# Altium schematic sheet 10-M2_GPS.SchDoc
size B
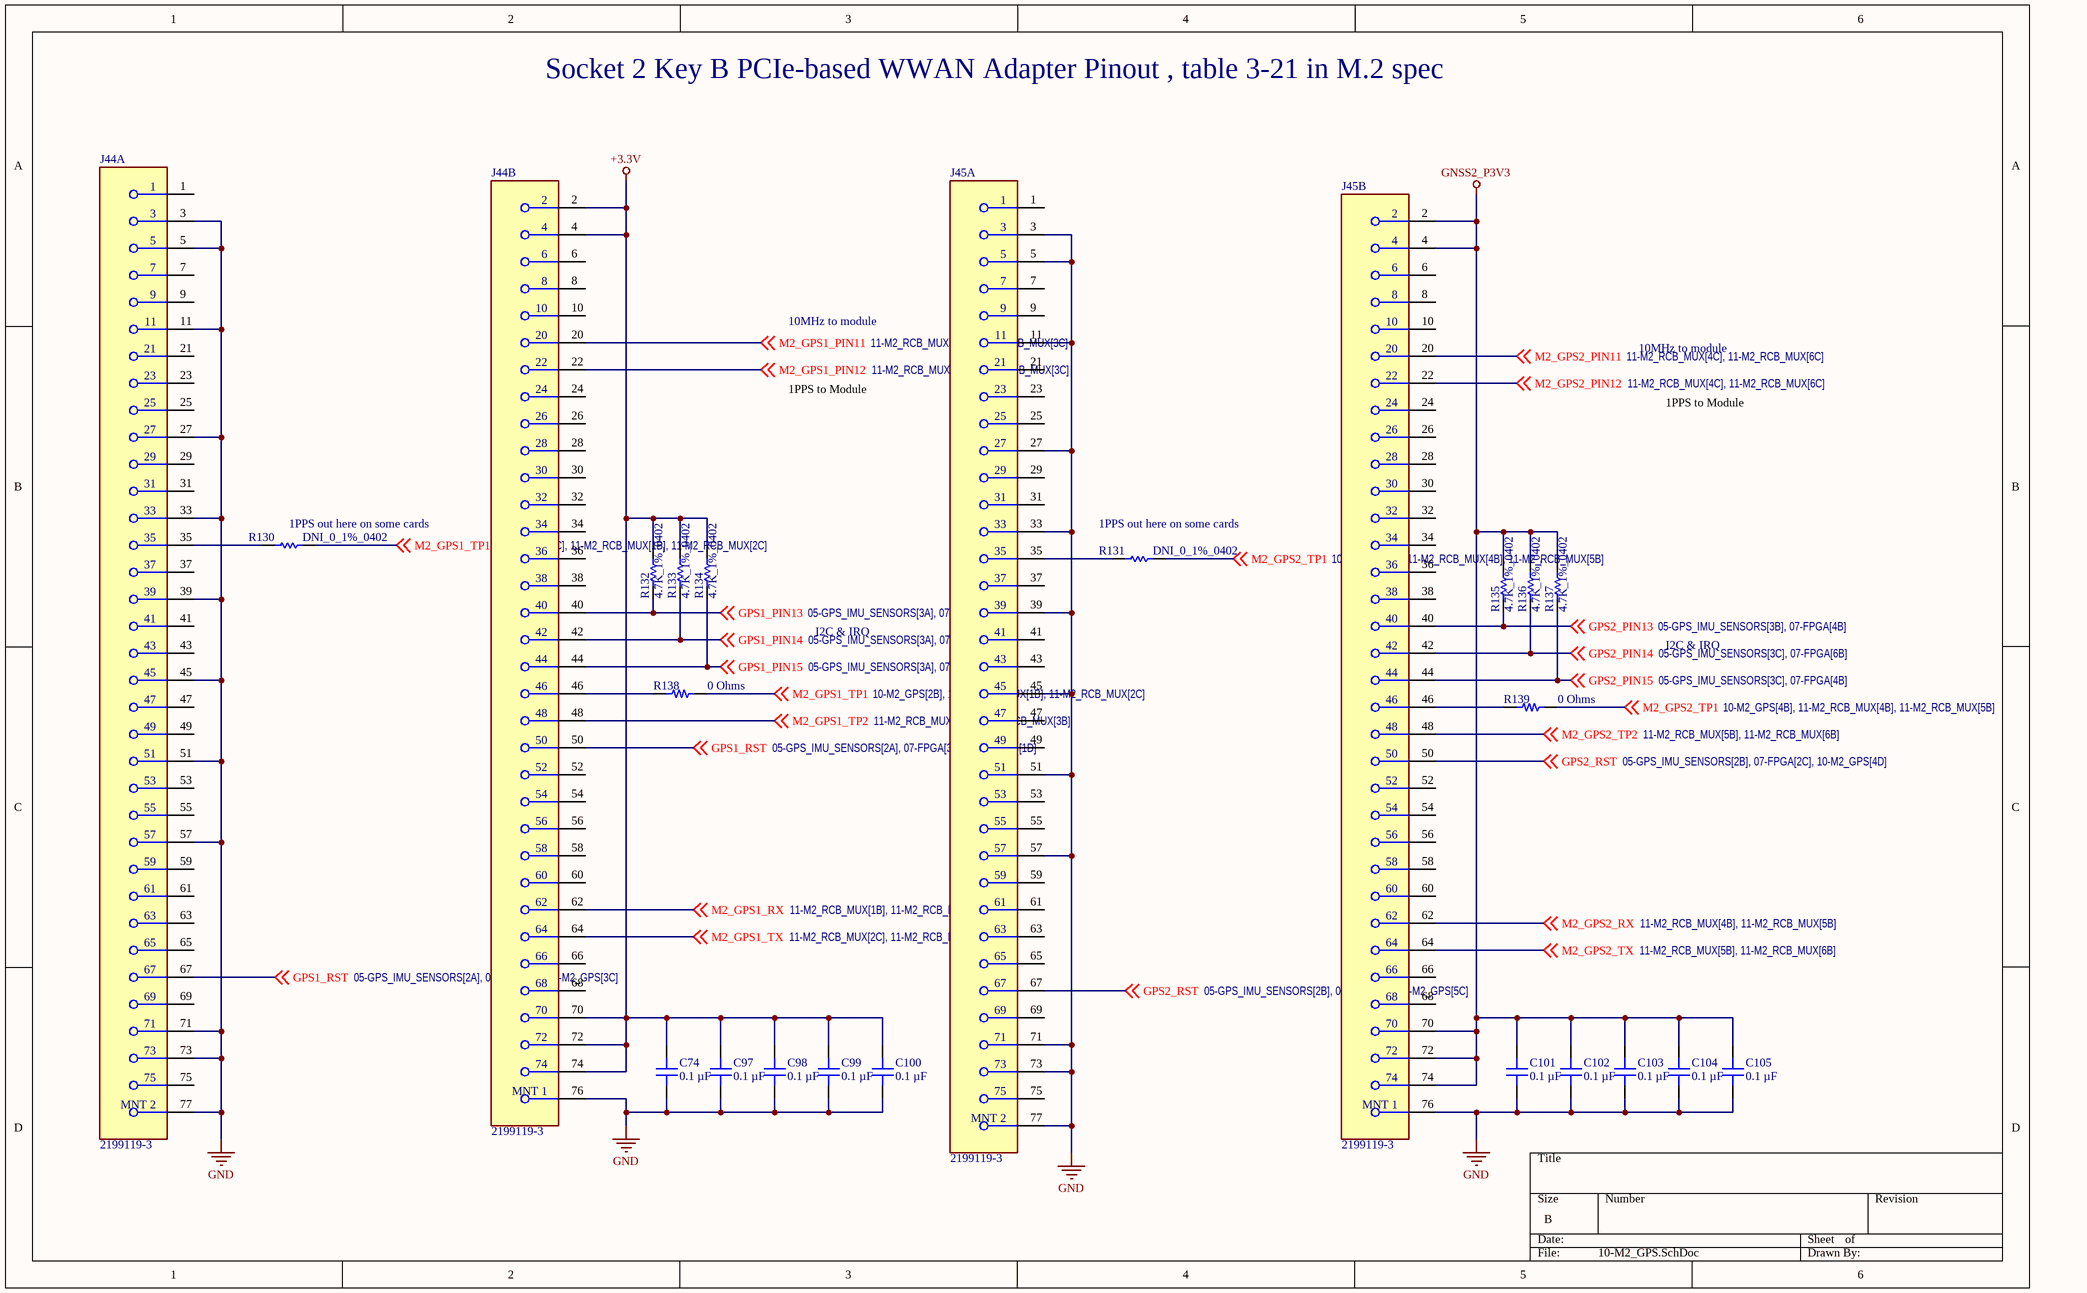
[diagram p0: 10-M2_GPS.SchDoc]

## Parts
C74  0.1 µF  [CAP 0402_1005]
C97  0.1 µF  [CAP 0402_1005]
C98  0.1 µF  [CAP 0402_1005]
C99  0.1 µF  [CAP 0402_1005]
C100  0.1 µF  [CAP 0402_1005]
C101  0.1 µF  [CAP 0402_1005]
C102  0.1 µF  [CAP 0402_1005]
C103  0.1 µF  [CAP 0402_1005]
C104  0.1 µF  [CAP 0402_1005]
C105  0.1 µF  [CAP 0402_1005]
J44  2199119-3  [FP-2199119-3-MFG]  (parts A,B of 2)
J45  2199119-3  [FP-2199119-3-MFG]  (parts A,B of 2)
R130  DNI_0_1%_0402  [RESC1005X40X25LL05T05]  (no BOM)
R131  DNI_0_1%_0402  [RESC1005X40X25LL05T05]  (no BOM)
R132  4.7K_1%_0402  [RESC1005X40X25NL10T10]
R133  4.7K_1%_0402  [RESC1005X40X25NL10T10]
R134  4.7K_1%_0402  [RESC1005X40X25NL10T10]
R135  4.7K_1%_0402  [RESC1005X40X25NL10T10]
R136  4.7K_1%_0402  [RESC1005X40X25NL10T10]
R137  4.7K_1%_0402  [RESC1005X40X25NL10T10]
R138  0 Ohms  [YAGEO RES 0402_1005]
R139  0 Ohms  [YAGEO RES 0402_1005]

## Nets
+3.3V: C74.1 C97.1 C98.1 C99.1 C100.1 J44.2 J44.4 J44.70 J44.72 J44.74 R132.2 R133.2 R134.2
GND: C74.2 C97.2 C98.2 C99.2 C100.2 C101.2 C102.2 C103.2 C104.2 C105.2 J44.3 J44.5 J44.11 J44.27 J44.33 J44.39 J44.45 J44.51 J44.57 J44.71 J44.73 J44.76(MNT_1) J44.77(MNT_2) J45.3 J45.5 J45.11 J45.27 J45.33 J45.39 J45.45 J45.51 J45.57 J45.71 J45.73 J45.76(MNT_1) J45.77(MNT_2)
GNSS2_P3V3: C101.1 C102.1 C103.1 C104.1 C105.1 J45.2 J45.4 J45.70 J45.72 J45.74 R135.2 R136.2 R137.2
GPS1_PIN13: J44.40 R132.1 ; off-sheet GPS1_PIN13
GPS1_PIN14: J44.42 R133.1 ; off-sheet GPS1_PIN14
GPS1_PIN15: J44.44 R134.1 ; off-sheet GPS1_PIN15
GPS1_RST: J44.50 J44.67 ; off-sheet GPS1_RST
GPS2_PIN13: J45.40 R135.1 ; off-sheet GPS2_PIN13
GPS2_PIN14: J45.42 R136.1 ; off-sheet GPS2_PIN14
GPS2_PIN15: J45.44 R137.1 ; off-sheet GPS2_PIN15
GPS2_RST: J45.50 J45.67 ; off-sheet GPS2_RST
M2_GPS1_PIN11: J44.20 ; off-sheet M2_GPS1_PIN11
M2_GPS1_PIN12: J44.22 ; off-sheet M2_GPS1_PIN12
M2_GPS1_RX: J44.62 ; off-sheet M2_GPS1_RX
M2_GPS1_TP1: R130.2 R138.2 ; off-sheet M2_GPS1_TP1
M2_GPS1_TP2: J44.48 ; off-sheet M2_GPS1_TP2
M2_GPS1_TX: J44.64 ; off-sheet M2_GPS1_TX
M2_GPS2_PIN11: J45.20 ; off-sheet M2_GPS2_PIN11
M2_GPS2_PIN12: J45.22 ; off-sheet M2_GPS2_PIN12
M2_GPS2_RX: J45.62 ; off-sheet M2_GPS2_RX
M2_GPS2_TP1: R131.2 R139.2 ; off-sheet M2_GPS2_TP1
M2_GPS2_TP2: J45.48 ; off-sheet M2_GPS2_TP2
M2_GPS2_TX: J45.64 ; off-sheet M2_GPS2_TX
NetJ44_35: J44.35 R130.1
NetJ44_46: J44.46 R138.1
NetJ45_35: J45.35 R131.1
NetJ45_46: J45.46 R139.1

Not connected (* = marked no-connect by the designer): J44 1 6 7 8 9 10 21 23 24 25 26 28 29 30 31 32 34 36 37 38 41 43 47 49 52 53 54 55 56 58 59 60 61 63 65 66 68 69 75; J45 1 6 7 8 9 10 21 23 24 25 26 28 29 30 31 32 34 36 37 38 41 43 47 49 52 53 54 55 56 58 59 60 61 63 65 66 68 69 75

## Notes on the sheet
- Socket 2 Key B PCIe-based WWAN Adapter Pinout , table 3-21 in M.2 spec
- 10MHz to module
- 1PPS to Module
- (near R130) 1PPS out here on some cards
- (near R131) 1PPS out here on some cards
- I2C & IRQ

## Library data of the parts
C74 C97-C105 = CC0402KRX7R9BB104: CAP CER 0.1UF 50V X7R 0402; manufacturer: Yageo; Tolerance: ±10%; Capacitance: 0.1 µF; series: CC; packaging: TapeAndReel; Part Number: CC0402KRX7R9BB104; Value: 0.1 µF; Applications: General Purpose; componentlink1description: Datasheet; componentlink1url: https://www.yageo.com/upload/media/product/productsearch/datasheet/mlcc/UPY-GPHC_X7R_6.3V-to-50V_18.pdf; componentlink2description: DigiKey Link; componentlink2url: https://www.digikey.com/en/products/detail/yageo/CC0402KRX7R9BB104/5883371; Device Package: 0402 (1005 Metric); lastupdated: 09.02.2024 20:04:27; Lifecycle Status: Active; Minimum Order: 10; Mounting Type: Surface Mount, MLCC; Operating Temperature: -55°C ~ 125°C; Package / Case: 0402 (1005 Metric); partid: 8451; Part Status: Active; price: 0.01; Size / Dimension: 0.039" L x 0.020" W (1.00mm x 0.50mm); Supplier 1: DigiKey; Supplier Part Number 1: 311-3566-1-ND; Temperature Coefficient: X7R; Thickness (Max): 0.022" (0.55mm); Voltage - Rated: 50V
J44 J45 = CMP-03365-000004-1: CONN M.2 FEMALE 67POS 0.020 GOLD; Contact Current Rating: 500mA; Number of Contacts: 67; PCB Mounting Orientation: Right Angle; Pitch: 0.5mm; Voltage Rating: 50V; Insulation Resistance: 500MR; Row Spacing: 7.55mm; Orientation: Right Angle; Length: 0.862inch; Radiation Hardening: No; Mount: Surface Mount; Contact Plating: Gold; Contact Material: Copper Alloy; Width: 8.7mm; Number of Rows: 2; Color: Black; ELV: Compliant; Housing Color: Black; Number of Positions: 67; Housing Material: Thermoplastic; Gender: Female; Min Operating Temperature: -40°C; Max Operating Temperature: 80°C; RoHS Compliant: Yes; Package Quantity: 1200; Packaging: Tape and Reel; Height: 3.2mm; Termination: Solder; Insulation Material: Thermoplastic; Max Voltage Rating (AC): 50V; Current Rating: 500mA
R130 R131 = CMP-2000-07451-1: Chip Resistor, 0 Ohm, 0.1 W, -55 to 155 degC, 0402 (1005 Metric), RoHS, Tape and Reel; Manufacturer: Panasonic; Voltage Rating (DC): 50V; Temperature Coefficient: 600ppm/��C; Max Power Dissipation: 100mW; Resistance: 0mOhm; Tolerance: 5%; Number of Terminations: 2; Mount: SurfaceMount; Height: 0.35mm; Packaging: TapeandReel; Contact Plating: Tin; Manufacturer URL: http://www.panasonic.com/; Composition: ThickFilm; Max Operating Temperature: 155degC; REACH SVHC: NoSVHC; Case/Package: 0402; Package Reference: 402; Depth: 0.5mm; Package Description: 2-Pin Surface Mount Device, Body 1 x 0.5 mm; Datasheet URL: https://industrial.panasonic.com/cdbs/www-data/pdf/RDA0000/AOA0000C301.pdf; RoHSCompliant: True; Case Code (Imperial): 0402; Military Standard: Not; Min Operating Temperature: -55degC; Power Rating: 100mW; Datasheet Version: 03/2015; Length: 1mm; Case Code (Metric): 1005; Termination: SMD/SMT; Mounting Technology: SurfaceMount; Voltage Rating: 50V; Width: 0.02inch; Package Quantity: 1; Lead Free: LeadFree; Radiation Hardening: No
R132-R137 = CMP-2002-05217-1: Manufacturer: Bourns; Part Number: CR0402-FX-4701GLF
R138 R139 = RC0402FR-070RL: RES 0 OHM JUMPER 1/16W 0402; Manufacturer: Yageo; Power (Watts): 0.063W, 1/16W; Number of Terminations: 2; Packaging: CutTape; Composition: Thick Film; Resistance: 0 Ohms; Tolerance: Jumper; Part Number: RC0402FR-070RL; Value: 0 Ohms; ComponentLink1Description: Datasheet; ComponentLink1URL: https://www.yageo.com/upload/media/product/productsearch/datasheet/rchip/PYu-RC_Group_51_RoHS_L_10.pdf; ComponentLink2Description: DigiKey Link; ComponentLink2URL: https://www.digikey.com/en/products/detail/yageo/RC0402FR-070RL/2827570; Device Package: 0402 (1005 Metric); Features: Moisture Resistant; Height - Seated (Max): 0.016" (0.40mm); LastUpdated: 25.07.2024 9:18:11; Lifecycle Status: Active; Minimum Order: 1; Operating Temperature: -55°C ~ 155°C; Package / Case: 0402 (1005 Metric); PartId: 17630; Part Status: Active; Price: 0.01; Series: RC_L; Size / Dimension: 0.039" L x 0.020" W (1.00mm x 0.50mm); Supplier 1: DigiKey; Supplier Part Number 1: 311-0.0LRCT-ND; Supplier Device Package: 0402